# Altium schematic sheet KANE_403.SchDoc: Mirrorcle Driver
size A; DrawnBy: Kieran Sweeney; Engineer: Kieran Sweeney; Organization: 403 Capstone Kane 2020; DocumentNumber: 1; Revision: 1; SheetNumber: 1
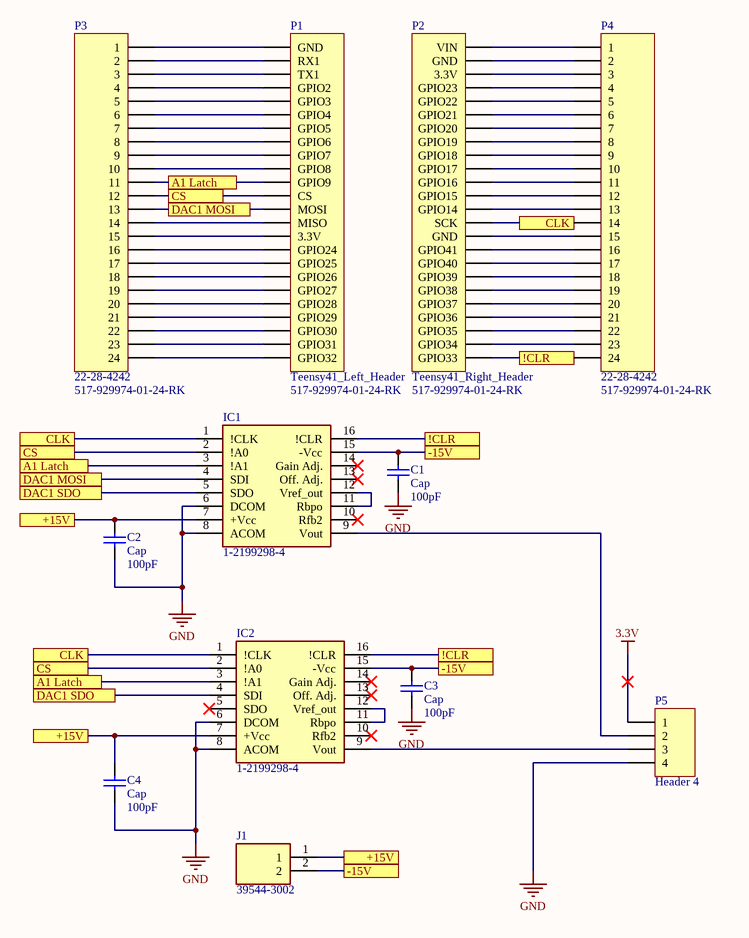
[diagram p0: KANE_403.SchDoc]

## Parts
C1  Cap  value 100pF  [RAD-0.3]
C2  Cap  value 100pF  [RAD-0.3]
C3  Cap  value 100pF  [RAD-0.3]
C4  Cap  value 100pF  [RAD-0.3]
IC1  1-2199298-4  [DIPS762W70P254L2032H510Q16N]
IC2  1-2199298-4  [DIPS762W70P254L2032H510Q16N]
J1  39544-3002  [395443002]
P1  Teensy41_Left_Header  Supplier Part Number 1: 517-929974-01-24-RK  [HDR1X24]
P2  Teensy41_Right_Header  Supplier Part Number 1: 517-929974-01-24-RK  [HDR1X24]
P3  22-28-4242  Supplier Part Number 1: 517-929974-01-24-RK  [22-28-4242]
P4  22-28-4242  Supplier Part Number 1: 517-929974-01-24-RK  [22-28-4242]
P5  Header 4  [HDR1X4]

## Ports
!CLR, +15V, -15V, A1 Latch, CLK, CS, DAC1 MOSI, DAC1 SDO

## Nets
3.3V: P5.1
GND: C1.1 C2.1 C3.1 C4.1 IC1.6(DCOM) IC1.8(ACOM) IC2.6(DCOM) IC2.8(ACOM) P5.4
!CLR: IC1.16(!CLR) IC2.16(!CLR) P2.24(GPIO33) P4.24 ; port !CLR
+15V: C2.2 C4.2 IC1.7(+Vcc) IC2.7(+Vcc) J1.1 ; port +15V
-15V: C1.2 C3.2 IC1.15(-Vcc) IC2.15(-Vcc) J1.2 ; port -15V
A1 Latch: IC1.3(!A1) IC2.3(!A1) P1.11(GPIO9) P3.11 ; port A1 Latch
CLK: IC1.1(!CLK) IC2.1(!CLK) P2.14(SCK) P4.14 ; port CLK
CS: IC1.2(!A0) IC2.2(!A0) P1.12(CS) P3.12 ; port CS
DAC1 MOSI: IC1.4(SDI) P1.13(MOSI) P3.13 ; port DAC1 MOSI
DAC1 SDO: IC1.5(SDO) IC2.4(SDI) ; port DAC1 SDO
NetIC1_9: IC1.9(Vout) P5.2
NetIC1_11: IC1.11(Rbpo) IC1.12(Vref_out)
NetIC2_9: IC2.9(Vout) P5.3
NetIC2_11: IC2.11(Rbpo) IC2.12(Vref_out)
NetP1_1: P1.1(GND) P3.1
NetP1_2: P1.2(RX1) P3.2
NetP1_3: P1.3(TX1) P3.3
NetP1_4: P1.4(GPIO2) P3.4
NetP1_5: P1.5(GPIO3) P3.5
NetP1_6: P1.6(GPIO4) P3.6
NetP1_7: P1.7(GPIO5) P3.7
NetP1_8: P1.8(GPIO6) P3.8
NetP1_9: P1.9(GPIO7) P3.9
NetP1_10: P1.10(GPIO8) P3.10
NetP1_14: P1.14(MISO) P3.14
NetP1_15: P1.15(3.3V) P3.15
NetP1_16: P1.16(GPIO24) P3.16
NetP1_17: P1.17(GPIO25) P3.17
NetP1_18: P1.18(GPIO26) P3.18
NetP1_19: P1.19(GPIO27) P3.19
NetP1_20: P1.20(GPIO28) P3.20
NetP1_21: P1.21(GPIO29) P3.21
NetP1_22: P1.22(GPIO30) P3.22
NetP1_23: P1.23(GPIO31) P3.23
NetP1_24: P1.24(GPIO32) P3.24
NetP2_1: P2.1(VIN) P4.1
NetP2_2: P2.2(GND) P4.2
NetP2_3: P2.3(3.3V) P4.3
NetP2_4: P2.4(GPIO23) P4.4
NetP2_5: P2.5(GPIO22) P4.5
NetP2_6: P2.6(GPIO21) P4.6
NetP2_7: P2.7(GPIO20) P4.7
NetP2_8: P2.8(GPIO19) P4.8
NetP2_9: P2.9(GPIO18) P4.9
NetP2_10: P2.10(GPIO17) P4.10
NetP2_11: P2.11(GPIO16) P4.11
NetP2_12: P2.12(GPIO15) P4.12
NetP2_13: P2.13(GPIO14) P4.13
NetP2_15: P2.15(GND) P4.15
NetP2_16: P2.16(GPIO41) P4.16
NetP2_17: P2.17(GPIO40) P4.17
NetP2_18: P2.18(GPIO39) P4.18
NetP2_19: P2.19(GPIO38) P4.19
NetP2_20: P2.20(GPIO37) P4.20
NetP2_21: P2.21(GPIO36) P4.21
NetP2_22: P2.22(GPIO35) P4.22
NetP2_23: P2.23(GPIO34) P4.23

Not connected (* = marked no-connect by the designer): IC1 10(Rfb2)* 13(Off._Adj.)* 14(Gain_Adj.)*; IC2 5(SDO)* 10(Rfb2)* 13(Off._Adj.)* 14(Gain_Adj.)*

## Library data of the parts
C1-C4 = Cap: Capacitor; Published: 8-Jun-2000; LatestRevisionDate: 17-Jul-2002; LatestRevisionNote: Re-released for DXP Platform.; PackageReference: RAD-0.3; Publisher: Altium Limited; PackageDescription: Radial Cap, Thru-Hole; 2 Leads; 0.3 in Pin Spacing
IC1 IC2 = 1-2199298-4: Integrated Circuit; Manufacturer_Name: TE Connectivity; Datasheet Link: https://www.te.com/commerce/DocumentDelivery/DDEController?Action=showdoc&DocId=Customer+Drawing%7F2199298%7FA%7Fpdf%7FEnglish%7FENG_CD_2199298_A_baseFilename.pdf%7F1-2199298-4; Height: 5.1mm; Manufacturer_Part_Number: 1-2199298-4
J1 = 39544-3002: Connector; Manufacturer_Name: Molex; Datasheet Link: https://componentsearchengine.com/Datasheets/2/39544-3002.pdf; Height: 14.4mm; Manufacturer_Part_Number: 39544-3002
P1 = Teensy41_Left_Header: 929974-01-24-RK Header, 24-Pin. Teensy 4.1 compatible.; LatestRevisionDate: 17-Jul-2002; LatestRevisionNote: Re-released for DXP Platform.; Publisher: Altium Limited; Supplier 1: Mouser
P2 = Teensy41_Right_Header: 929974-01-24-RK_1 Header, 24-Pin. Teensy 4.1 compatible.; LatestRevisionDate: 17-Jul-2002; LatestRevisionNote: Re-released for DXP Platform.; Publisher: Altium Limited; Supplier 1: Mouser
P3 P4 = 22-28-4242: 929974-01-24-RK Header, 24-Pin. Teensy 4.1 compatible.; LatestRevisionDate: 17-Jul-2002; LatestRevisionNote: Re-released for DXP Platform.; Publisher: Altium Limited; Supplier 1: Mouser
P5 = Header 4: Header, 4-Pin; LatestRevisionDate: 17-Jul-2002; LatestRevisionNote: Re-released for DXP Platform.; Publisher: Altium Limited